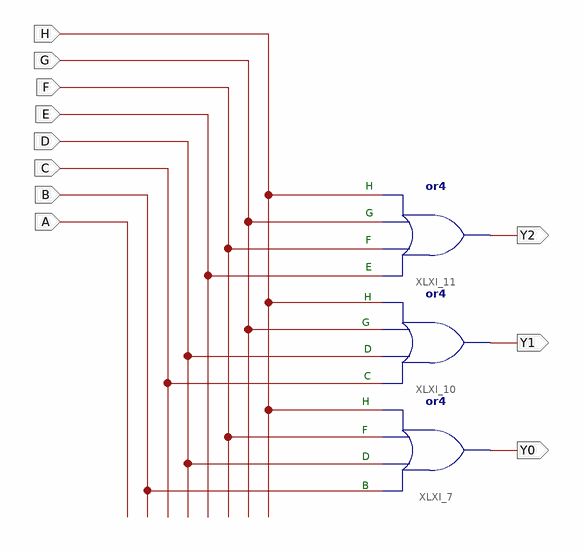
[diagram p0: schematic sheet 1]
// Xilinx ISE schematic onehot_encoder_8.sch (zynq) as structural Verilog: 3 symbols, 11 ports
module onehot_encoder_8 (
  input  H,
  input  G,
  input  F,
  input  E,
  input  A,
  input  C,
  input  D,
  input  B,
  output Y0,
  output Y1,
  output Y2
);

  or XLXI_7 (Y0, B, D, F, H);
  or XLXI_10 (Y1, C, D, G, H);
  or XLXI_11 (Y2, E, F, G, H);

  // Notes on the sheet:
  //   H
  //   G
  //   F
  //   E
  //   H
  //   G
  //   D
  //   C
  //   H
  //   F
  //   D
  //   B
endmodule
